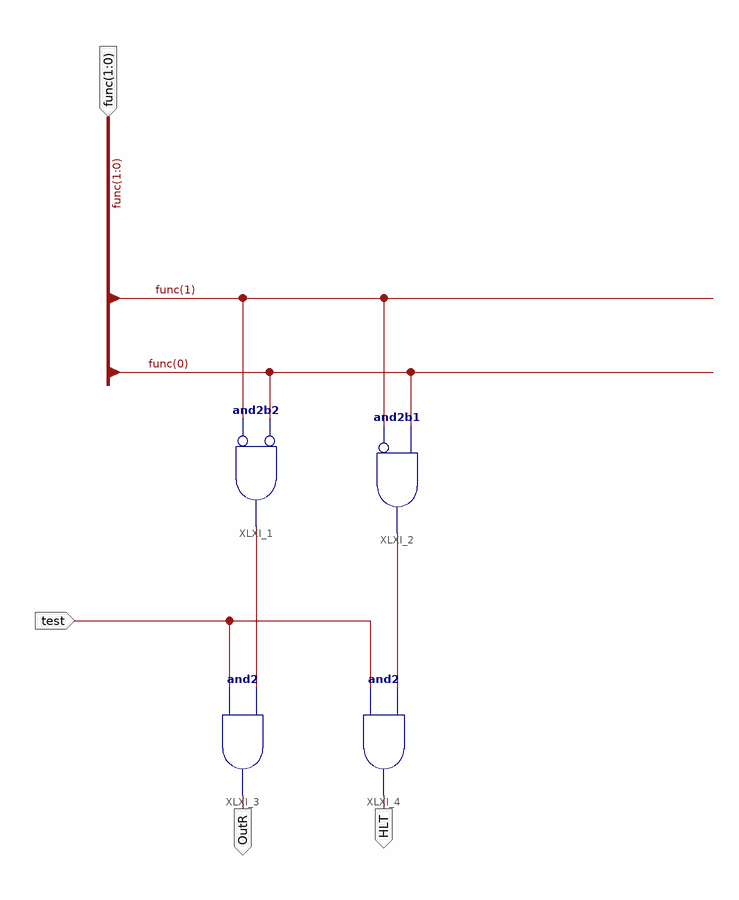
[diagram p0: schematic sheet 1]
// Xilinx ISE schematic test_decoder.sch (spartan3e) as structural Verilog: 4 symbols, 4 ports
module test_decoder (
  input  [1:0] func,
  input  test,
  output OutR,
  output HLT
);

  and XLXI_1 (OutR, ~func[1], ~func[0]);  // and2b2
  and XLXI_2 (HLT, ~func[1], func[0]);  // and2b1
  and XLXI_3 (OutR, test, OutR);
  and XLXI_4 (HLT, test, HLT);
endmodule
